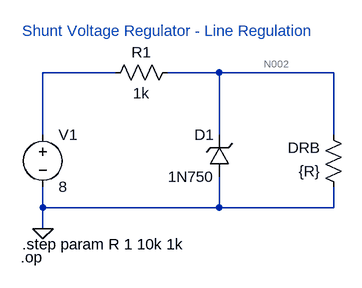
[diagram p0: schematic Shunt Voltage Regulator.asc]
Shunt Voltage Regulator.asc, the LTspice schematic file:
Version 4
SHEET 1 880 680
WIRE 16 80 -96 80
WIRE 176 80 96 80
WIRE 352 80 176 80
WIRE -96 176 -96 80
WIRE 176 176 176 80
WIRE 352 176 352 80
WIRE -96 288 -96 256
WIRE 176 288 176 240
WIRE 176 288 -96 288
WIRE 352 288 352 256
WIRE 352 288 176 288
WIRE -96 320 -96 288
FLAG -96 320 0
SYMBOL res 112 64 R90
WINDOW 0 0 56 VBottom 2
WINDOW 3 32 56 VTop 2
SYMATTR InstName R1
SYMATTR Value 1k
SYMBOL res 368 272 R180
WINDOW 0 36 76 Left 2
WINDOW 3 36 40 Left 2
SYMATTR InstName DRB
SYMATTR Value {R}
SYMBOL zener 192 240 R180
WINDOW 0 24 64 Left 2
WINDOW 3 24 0 Left 2
SYMATTR InstName D1
SYMATTR Value 1N750
SYMBOL voltage -96 160 R0
WINDOW 123 0 0 Left 0
WINDOW 39 0 0 Left 0
SYMATTR InstName V1
SYMATTR Value 8
TEXT -128 344 Left 2 !.step param R 1 10k 1k
TEXT -128 16 Left 2 ;Shunt Voltage Regulator - Line Regulation
TEXT -130 364 Left 2 !.op

The netlist it stands for:
* Shunt Voltage Regulator.asc
R1 N002 N001 1k
R§DRB 0 N002 {R}
D1 0 N002 1N750
V1 N001 0 8
.model D D
.lib standard.dio
.step param R 1 10k 1k
* Shunt Voltage Regulator - Line Regulation
.op
.backanno
.end

* Results of the author's LTspice run, read from the files saved beside the schematic
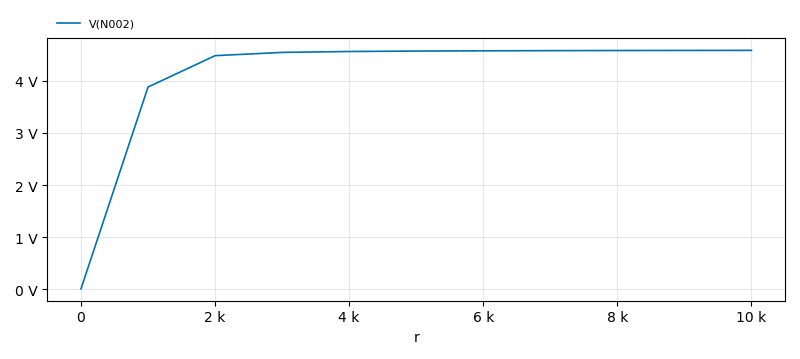
[diagram p1: Operating Point of Shunt Voltage Regulator.asc, plotted from the saved traces]
* Operating Point, 1 run:
*   V(N002): 7.992 mV at r=1 , 4.586 V at r=10 k, min 7.992 mV, max 4.586 V
* From the log:
*   Semiconductor Device Operating Points:
*                           --- Diodes ---
*   Name:      d1
*   Model:    1n750
*   Id:     -4.92e-10
*   Vd:     -7.99e-03
*   Req:     3.14e+07
*   CAP:     1.74e-10